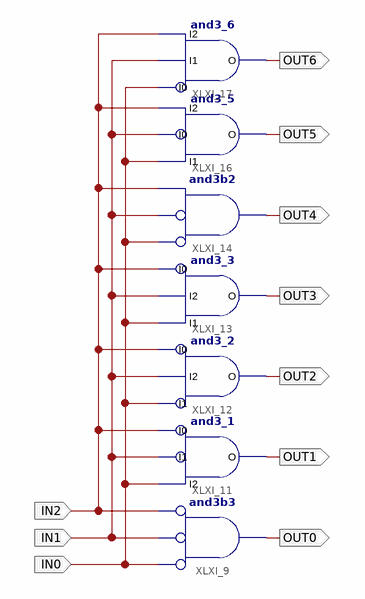
[diagram p0: schematic sheet 1]
// Xilinx ISE schematic Decoder3to7.sch (spartan3a) as structural Verilog: 7 symbols, 10 ports
module Decoder3to7 (
  input  IN0,
  input  IN1,
  input  IN2,
  output OUT0,
  output OUT1,
  output OUT2,
  output OUT3,
  output OUT4,
  output OUT5,
  output OUT6
);

  and XLXI_9 (OUT0, ~IN0, ~IN1, ~IN2);  // and3b3
  and3_1 XLXI_11 (.I1(IN1), .O(OUT1), .I0(IN2), .I2(IN0));
  and3_2 XLXI_12 (.O(OUT2), .I0(IN2), .I1(IN0), .I2(IN1));
  and3_3 XLXI_13 (.O(OUT3), .I1(IN0), .I0(IN2), .I2(IN1));
  and XLXI_14 (OUT4, ~IN0, ~IN1, IN2);  // and3b2
  and3_5 XLXI_16 (.I2(IN2), .O(OUT5), .I0(IN1), .I1(IN0));
  and3_6 XLXI_17 (.I2(IN2), .O(OUT6), .I1(IN1), .I0(IN0));
endmodule
